# EAGLE design EVB2_MC33812_Rev 2.2 (EAGLE 4.15)
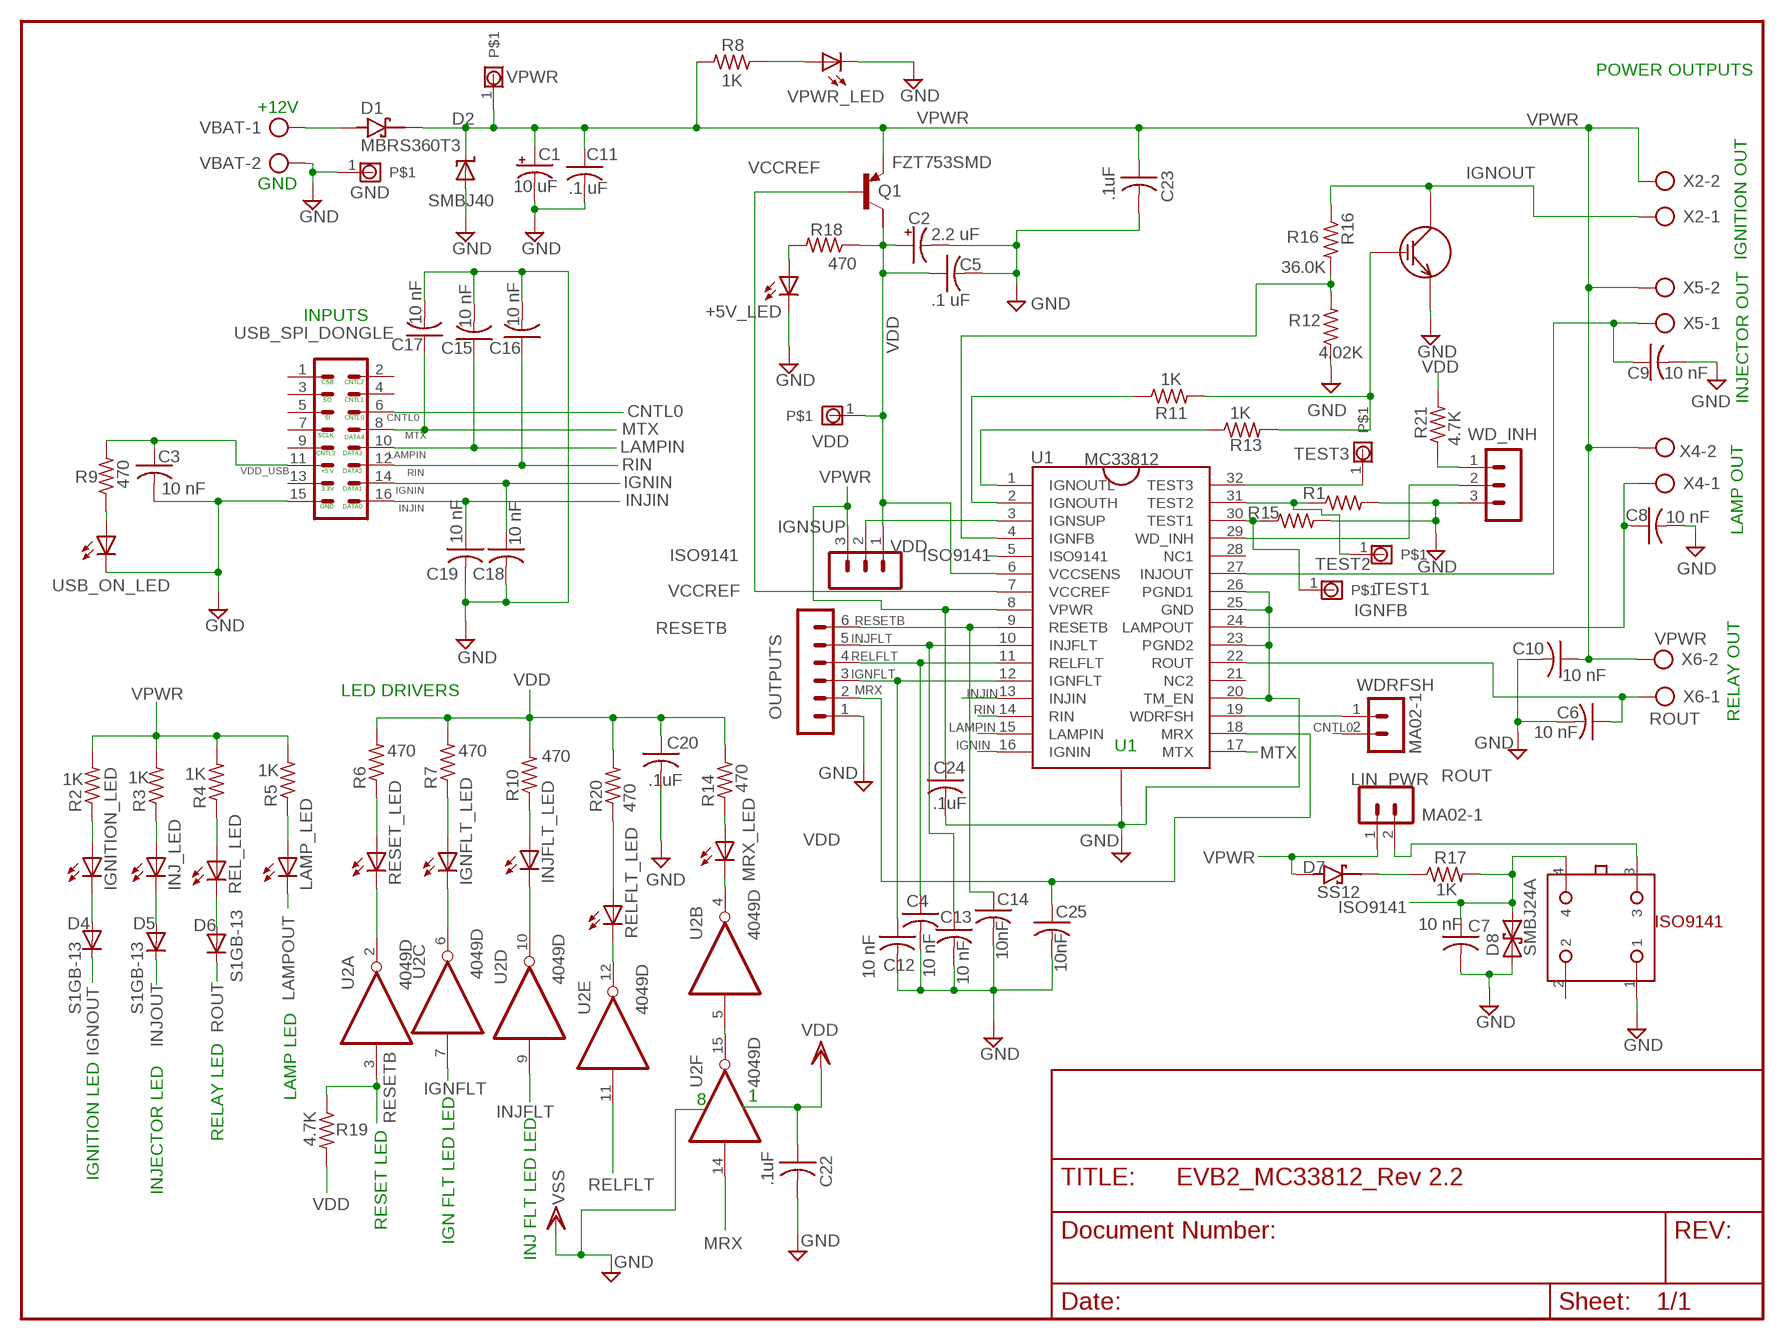
[diagram p0: schematic, sheet 1]

## Parts
+5V_LED  LEDCHIPLED_0805  [CHIPLED_0805]
C1  10 uF  CPOL-USE  [PANASONIC_E]
C2  2.2 uF  CPOL-USC  [PANASONIC_C]
C3  10 nF  C-USC0805  [C0805]
C4  10 nF  C-USC0805  [C0805]
C5  .1 uF  C-USC0805  [C0805]
C6  10 nF  C-USC0805  [C0805]
C7  10 nF  C-USC0805  [C0805]
C8  10 nF  C-USC0805  [C0805]
C9  10 nF  C-USC0805  [C0805]
C10  10 nF  C-USC0805  [C0805]
C11  .1 uF  C-USC0805  [C0805]
C12  10 nF  C-USC0805  [C0805]
C13  10 nF  C-USC0805  [C0805]
C14  10nF  C-USC0805  [C0805]
C15  10 nF  C-USC0805  [C0805]
C16  10 nF  C-USC0805  [C0805]
C17  10 nF  C-USC0805  [C0805]
C18  10 nF  C-USC0805  [C0805]
C19  10 nF  C-USC0805  [C0805]
C20  .1uF  C-USC0805  [C0805]
C22  .1uF  C-USC0805  [C0805]
C23  .1uF  C-USC0805  [C0805]
C24  .1uF  C-USC0805  [C0805]
C25  10nF  C-USC0805  [C0805]
D1  MBRS360T3  [SMC]
D2  SMBJ40  [DO214AA]
D4  S1GB-13  [DO214AA]
D5  S1GB-13  [DO214AA]
D6  S1GB-13  [DO214AA]
D7  SS12  [DO214AC]
D8  SMBJ24A  [DO214AA]
IGNFLT_LED  LEDCHIPLED_0805  [CHIPLED_0805]
IGNITION_LED  LEDCHIPLED_0805  [CHIPLED_0805]
IGNSUP  MA03-1  [MA03-1]
INJ_LED  LEDCHIPLED_0805  [CHIPLED_0805]
INJFLT_LED  LEDCHIPLED_0805  [CHIPLED_0805]
ISO9141  44068ANGLE  [5566-4A]
LAMP_LED  LEDCHIPLED_0805  [CHIPLED_0805]
LIN_PWR  MA02-1  [MA02-1]
MRX_LED  LEDCHIPLED_0805  [CHIPLED_0805]
OUTPUTS  MA06-1  [MA06-1]
Q1  FZT753SMD  [SOT223]
Q3  IRGS14C40L  [T0263N]
R1  R-US_R0805  [R0805]
R2  1K  R-US_M0805  [M0805]
R3  1K  R-US_M0805  [M0805]
R4  1K  R-US_M0805  [M0805]
R5  1K  R-US_M0805  [M0805]
R6  470  R-US_M0805  [M0805]
R7  470  R-US_M0805  [M0805]
R8  1K  R-US_M0805  [M0805]
R9  470  R-US_M0805  [M0805]
R10  470  R-US_M0805  [M0805]
R11  1K  R-US_M0805  [M0805]
R12  4.02K  R-US_R1206  [R1206]
R13  1K  R-US_M0805  [M0805]
R14  470  R-US_M0805  [M0805]
R15  R-US_R0805  [R0805]
R16  36.0K  R-US_R2512  [R2512]
R17  1K  R-US_M0805  [M0805]
R18  470  R-US_M0805  [M0805]
R19  4.7K  R-US_M0805  [M0805]
R20  470  R-US_M0805  [M0805]
R21  4.7K  R-US_M0805  [M0805]
REL_LED  LEDCHIPLED_0805  [CHIPLED_0805]
RELFLT_LED  LEDCHIPLED_0805  [CHIPLED_0805]
RESET_LED  LEDCHIPLED_0805  [CHIPLED_0805]
TEST1  MA01-1  [MA01-1]
TEST2  MA01-1  [MA01-1]
TEST3  MA01-1  [MA01-1]
U1  MC33812A  [32SOICEP_FINAL]
U2  4049D  [SO16]
U$2  MA01-1  [MA01-1]
USB_ON_LED  LEDCHIPLED_0805  [CHIPLED_0805]
USB_SPI_DONGLE  MA08-2  [MA08-2]
VBAT  AK500/2  [AK500/2]
VDD  MA01-1  [MA01-1]
VPWR  MA01-1  [MA01-1]
VPWR_LED  LEDCHIPLED_0805  [CHIPLED_0805]
WD_INH  MA03-1  [MA03-1]
WDRFSH  MA02-1  [MA02-1]
X2  AK500/2  [AK500/2]
X4  AK500/2  [AK500/2]
X5  AK500/2  [AK500/2]
X6  AK500/2  [AK500/2]

## Nets
CNTL0: USB_SPI_DONGLE.6 WDRFSH.2
GND: +5V_LED.C C1.- C2.- C3.2 C4.2 C5.2 C6.2 C7.2 C8.2 C9.2 C10.2 C11.2 C12.2 C13.2 C14.2 C15.2 C16.2 C17.2 C18.2 C19.2 C20.2 C22.2 C23.2 C24.2 C25.2 D2.A D8.A ISO9141.1 OUTPUTS.1 Q3.E R1.2 R12.1 R15.2 U1.20(TM_EN) U1.23(PGND2) U1.25(GND) U1.26(PGND1) U1.P$1(PAD_GND_0) U$2.1 USB_ON_LED.C USB_SPI_DONGLE.15 VBAT.2 VPWR_LED.C WD_INH.3 ; supply symbol labelled VSS
IGNFB: R12.2 R16.2 U1.4(IGNFB)
IGNFLT: C12.1 OUTPUTS.3 U1.12(IGNFLT) U2.7(C:I)
IGNFLT_LED_A: IGNFLT_LED.A R7.1
IGNFLT_LED_C: IGNFLT_LED.C U2.6(C:O)
IGNIN: C18.1 U1.16(IGNIN) USB_SPI_DONGLE.14
IGNOUT: D4.C Q3.C R16.1 X2.1
IGNOUTH: R11.1 U1.2(IGNOUTH)
IGNOUTL: R13.1 U1.1(IGNOUTL)
IGNSUP: IGNSUP.2 U1.3(IGNSUP)
INJFLT: C13.1 OUTPUTS.5 U1.10(INJFLT) U2.9(D:I)
INJFLT_LED_A: INJFLT_LED.A R10.1
INJFLT_LED_C: INJFLT_LED.C U2.10(D:O)
INJIN: C19.1 U1.13(INJIN) USB_SPI_DONGLE.16
INJOUT: C9.1 D5.C U1.27(INJOUT) X5.1
ISO9141: C7.1 D8.C ISO9141.4 R17.2 U1.5(ISO9141)
LAMP_LED_A: LAMP_LED.A R5.1
LAMPIN: C15.1 U1.15(LAMPIN) USB_SPI_DONGLE.10
LAMPOUT: C8.1 LAMP_LED.C U1.24(LAMPOUT) X4.1
MRX: C25.1 OUTPUTS.2 U1.18(MRX) U2.14(F:I)
MRX_LED_A: MRX_LED.A R14.1
MRX_LED_C: MRX_LED.C U2.4(B:O)
MTX: C17.1 U1.17(MTX) USB_SPI_DONGLE.8
N$1: +5V_LED.A R18.2
N$2: R21.1 WD_INH.1
N$4: U2.5(B:I) U2.15(F:O)
N$7: IGNITION_LED.A R2.1
N$8: INJ_LED.A R3.1
N$9: R4.1 REL_LED.A
N$12: D4.A IGNITION_LED.C
N$13: D5.A INJ_LED.C
N$14: D6.A REL_LED.C
N$18: R8.1 VPWR_LED.A
N$21: ISO9141.3 LIN_PWR.2
N$23: D7.C R17.1
N$33: Q3.G R11.2 R13.2
N$43: R9.1 USB_ON_LED.A
RELFLT: C4.1 OUTPUTS.4 U1.11(RELFLT) U2.11(E:I)
RELFLT_LED_A: R20.1 RELFLT_LED.A
RELFLT_LED_C: RELFLT_LED.C U2.12(E:O)
RESET_LED_A: R6.1 RESET_LED.A
RESET_LED_C: RESET_LED.C U2.2(A:O)
RESETB: C14.1 OUTPUTS.6 R19.1 U1.9(RESETB) U2.3(A:I)
RIN: C16.1 U1.14(RIN) USB_SPI_DONGLE.12
ROUT: C6.1 D6.C U1.22(ROUT) X6.1
TEST1: R15.1 TEST2.1 U1.30(TEST1)
TEST2: R1.1 TEST1.1 U1.31(TEST2)
TEST3: TEST3.1 U1.32(TEST3)
VBAT: D1.A VBAT.1
VCCREF: Q1.1(B) U1.7(VCCREF)
VDD: C2.+ C5.1 C20.1 C22.1 IGNSUP.1 Q1.2(C) R6.2 R7.2 R10.2 R14.2 R18.1 R19.2 R20.2 R21.2 U1.6(VCCSENS) VDD.1
VDD_USB: C3.1 R9.2 USB_SPI_DONGLE.11
VPWR: C1.+ C10.1 C11.1 C23.1 C24.1 D1.C D2.C D7.A IGNSUP.3 LIN_PWR.1 Q1.3(E) R2.2 R3.2 R4.2 R5.2 R8.2 U1.8(VPWR) VPWR.1 X2.2 X4.2 X5.2 X6.2
WD_INH: U1.29(WD_INH) WD_INH.2
WDRFSH: U1.19(WDRFSH) WDRFSH.1
Unconnected: ISO9141.2 Q1.4(C/) U1.21(NC2) U1.28(NC1) USB_SPI_DONGLE.1 USB_SPI_DONGLE.2 USB_SPI_DONGLE.3 USB_SPI_DONGLE.4 USB_SPI_DONGLE.5 USB_SPI_DONGLE.7 USB_SPI_DONGLE.9 USB_SPI_DONGLE.13

## Notes on the sheet
- POWER OUTPUTS
- +12V
- IGNITION OUT
- GND
- R16
- INPUTS
- CSB | CNTL2
- SO | CNTL1
- INJECTOR OUT
- SI | CNTL0
- SCLK
- DATA4
- CNTL3 | DATA3
- +5 V | DATA2
- 3.3V | DATA1
- GND | DATA0
- LAMP OUT
- LED DRIVERS
- RELAY OUT
- U1
- LAMP LED | 1
- 8
- RELAY LED
- IGNITION LED
- INJECTOR LED
- RESET LED
- IGN FLT LED LED
- INJ FLT LED LED

## Power pins joined to a net without a drawn wire
GND: U2.8(P:VSS)
VDD: U2.1(P:VDD)

## Library data of the parts
+5V_LED IGNFLT_LED IGNITION_LED INJ_LED INJFLT_LED LAMP_LED MRX_LED REL_LED RELFLT_LED RESET_LED USB_ON_LED VPWR_LED = led:LED: LED OSRAM: - CHIPLED LG R971, LG N971, LY N971, LG Q971, LY Q971, LO R971, LY R971 LH N974, LH R974 LS Q976, LO Q976, LY Q976 LO Q996 - Hyper CHIPLED LW Q18S LB Q993, LB Q99A, LB R99A - SideLED LS A670, LO A670, LY A670, LG A670, LP A670 LB A673, LV A673, LT A673, LW A673 LH A674 LY A675 LS A676, LA A676, LO A676, LY A676, LW A676 LS A679, LY A679, LG A679 - Hyper Micro SIDELED® LS Y876, LA Y876, LO Y876, LY Y876 LT Y87S - SmartLED LW L88C, LW L88S LB L89C, LB L89S, LG L890 LS L89K, LO L89K, LY L89K LS L896, LA L896, LO L896, LY L896 - TOPLED LS T670, LO T670, LY T670, LG T670, LP T670 LSG T670, LSP T670, LSY T670, LOP T670, LYG T670 LG T671, LOG T671, LSG T671 LB T673, LV T673, LT T673, LW T673 LH T674 LS T676, LA T676, LO T676, LY T676, LB T676, LH T676, LSB T676, LW T676 LB T67C, LV T67C, LT T67C, LS T67K, LO T67K, LY T67K, LW E67C LS E67B, LA E67B, LO E67B, LY E67B, LB E67C, LV E67C, LT E67C LW T67C LS T679, LY T679, LG T679 LS T770, LO T770, LY T770, LG T770, LP T770 LB T773, LV T773, LT T773, LW T773 LH T774 LS E675, LA E675, LY E675, LS T675 LS T776, LA T776, LO T776, LY T776, LB T776 LHGB T686 LT T68C, LB T68C - Hyper Mini TOPLED® LB M676 - Mini TOPLED Santana® LG M470 LS M47K, LO M47K, LY M47K Source: http://www.osram.convergy.de/
C1 C2 = rcl:CPOL-US: POLARIZED CAPACITOR, American symbol
C3-C20 C22-C25 = rcl:C-US: CAPACITOR, American symbol
D1 = diode:MBRS360T3
D2 = diode:SMBJ40
D4-D6 = diode:S1GB-13
D7 = diode:SS12
D8 = diode:SMBJ24A
IGNSUP WD_INH = con-lstb:MA03-1: PIN HEADER
ISO9141 = con-molex:44068ANGLE
LIN_PWR WDRFSH = con-lstb:MA02-1
OUTPUTS = con-lstb:MA06-1: PIN HEADER
Q1 = transistor-pnp:FZT753SMD: PNP Transistor
Q3 = APD:IRGS14C40L
R1-R21 = rcl:R-US_: RESISTOR, American symbol
TEST1-TEST3 U$2 VDD VPWR = con-lstb:MA01-1
U1 = SeaBreeze_EVB:MC33812A
U2 = 40xx:4049: Hex inverting BUFFER
USB_SPI_DONGLE = con-lstb:MA08-2: PIN HEADER
VBAT X2 X4-X6 = con-ptr500:AK500/2: CONNECTOR

## Board
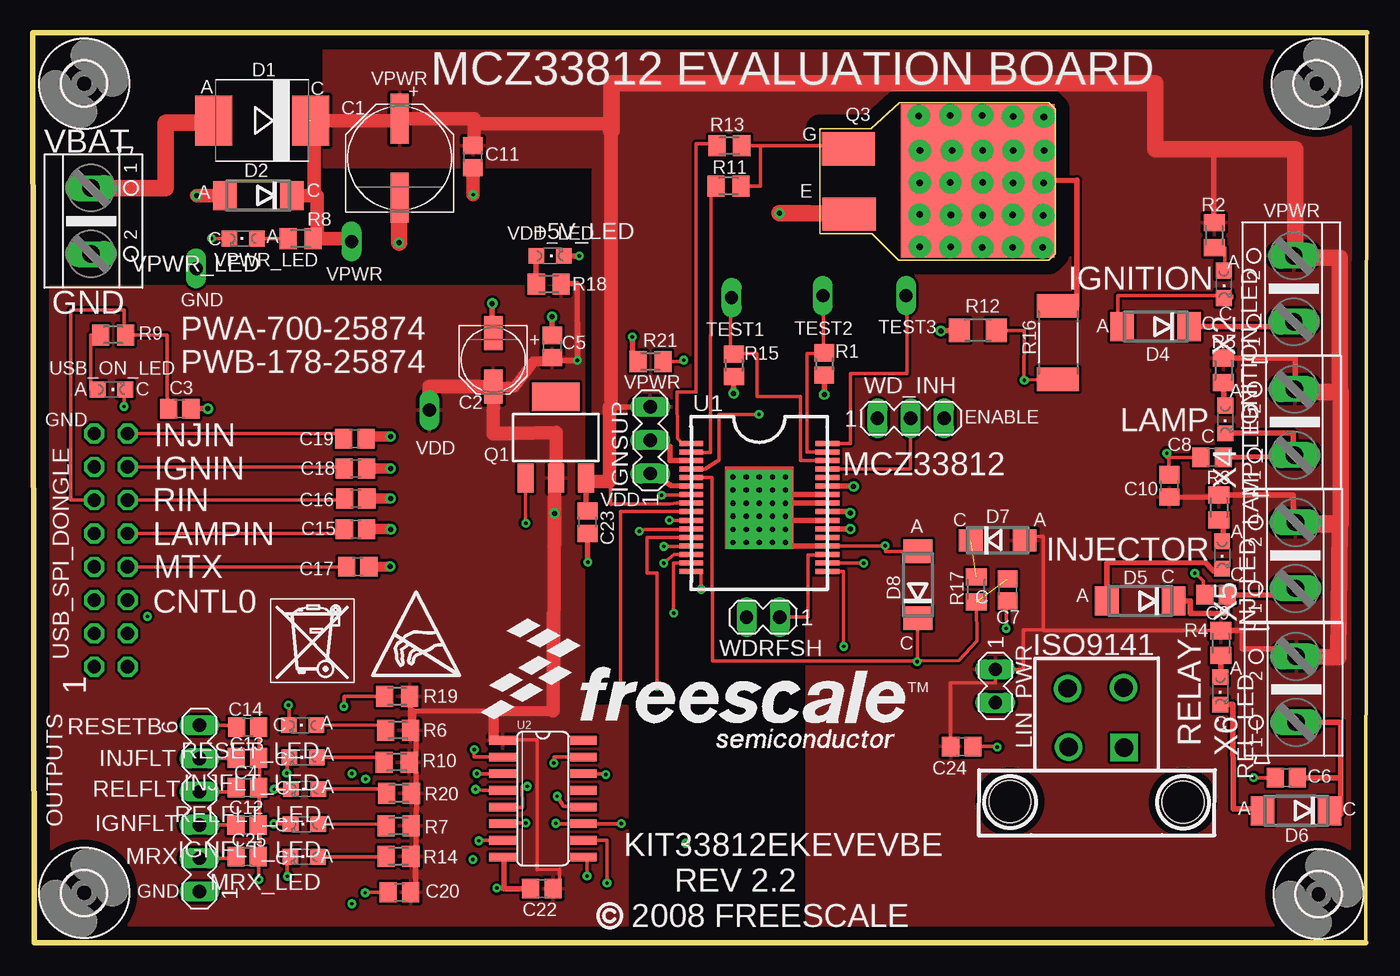
[diagram p1: board, top side]
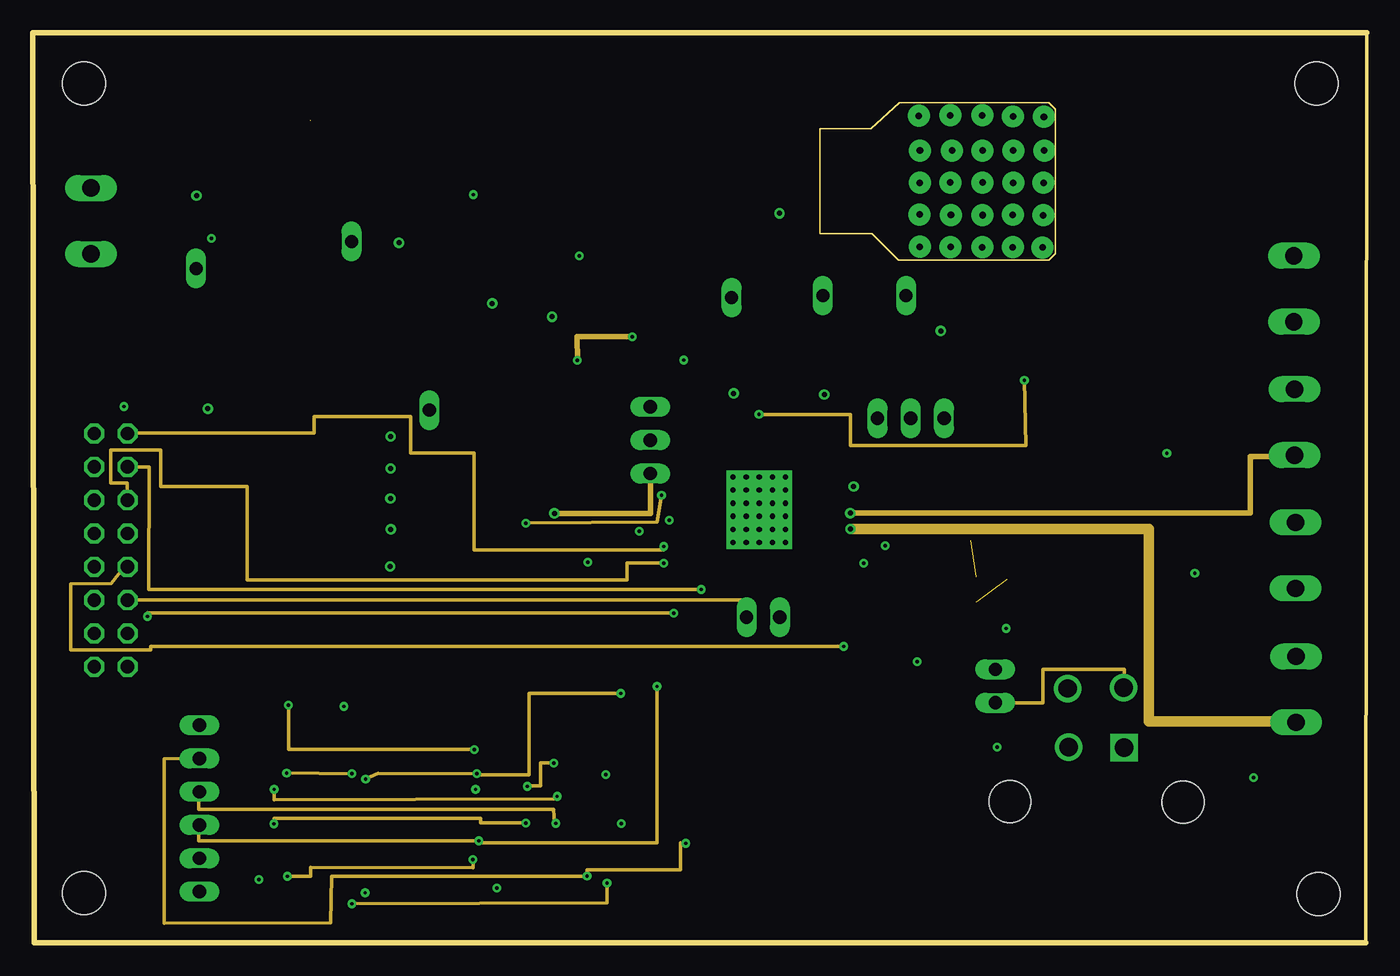
[diagram p2: board, inner layer Route2]
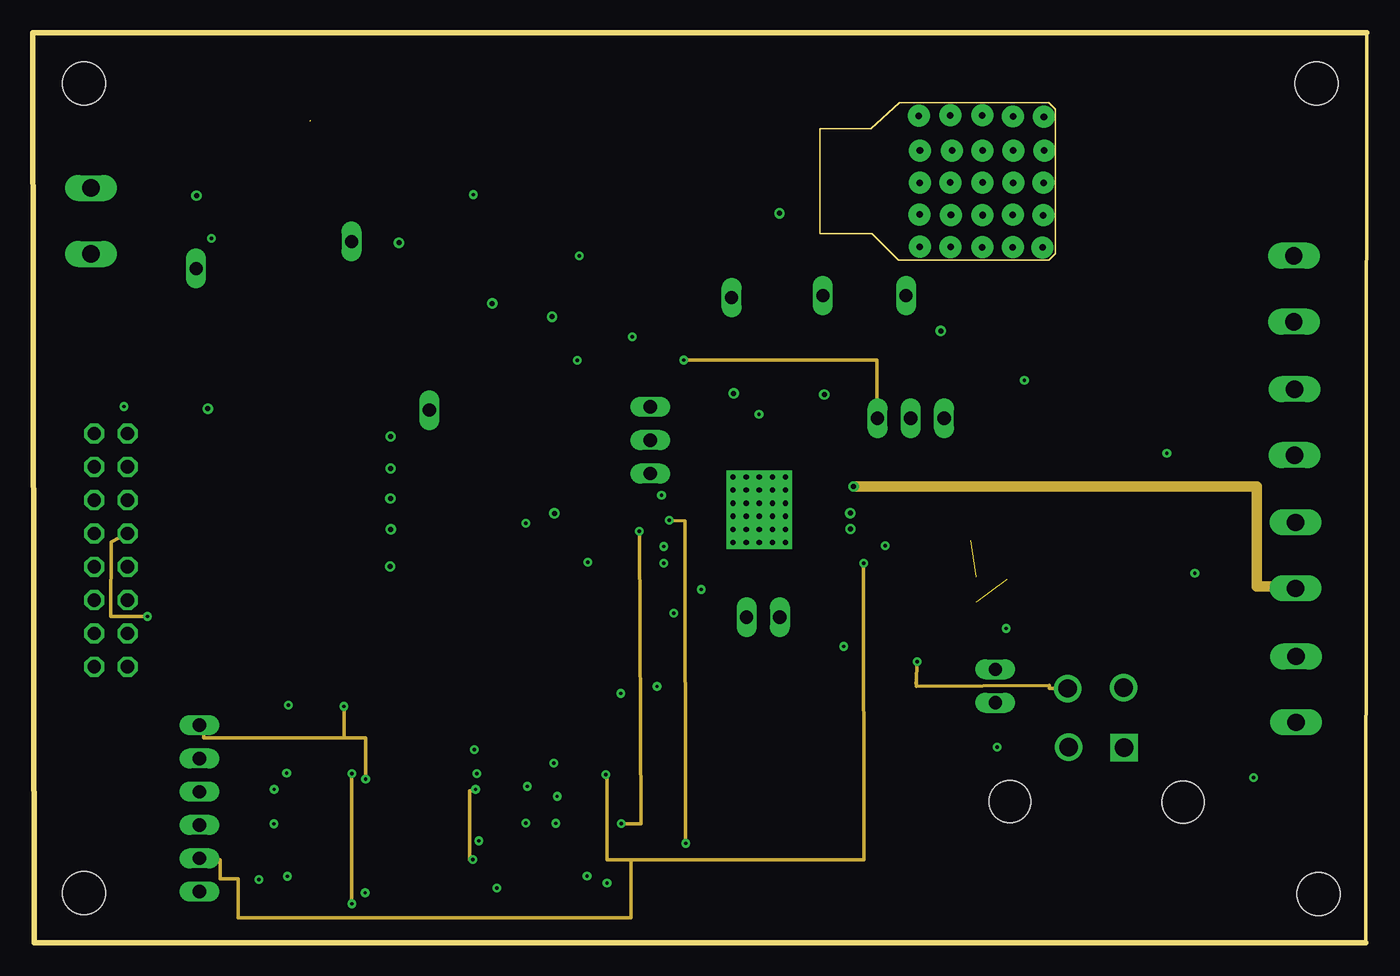
[diagram p3: board, inner layer Route15]
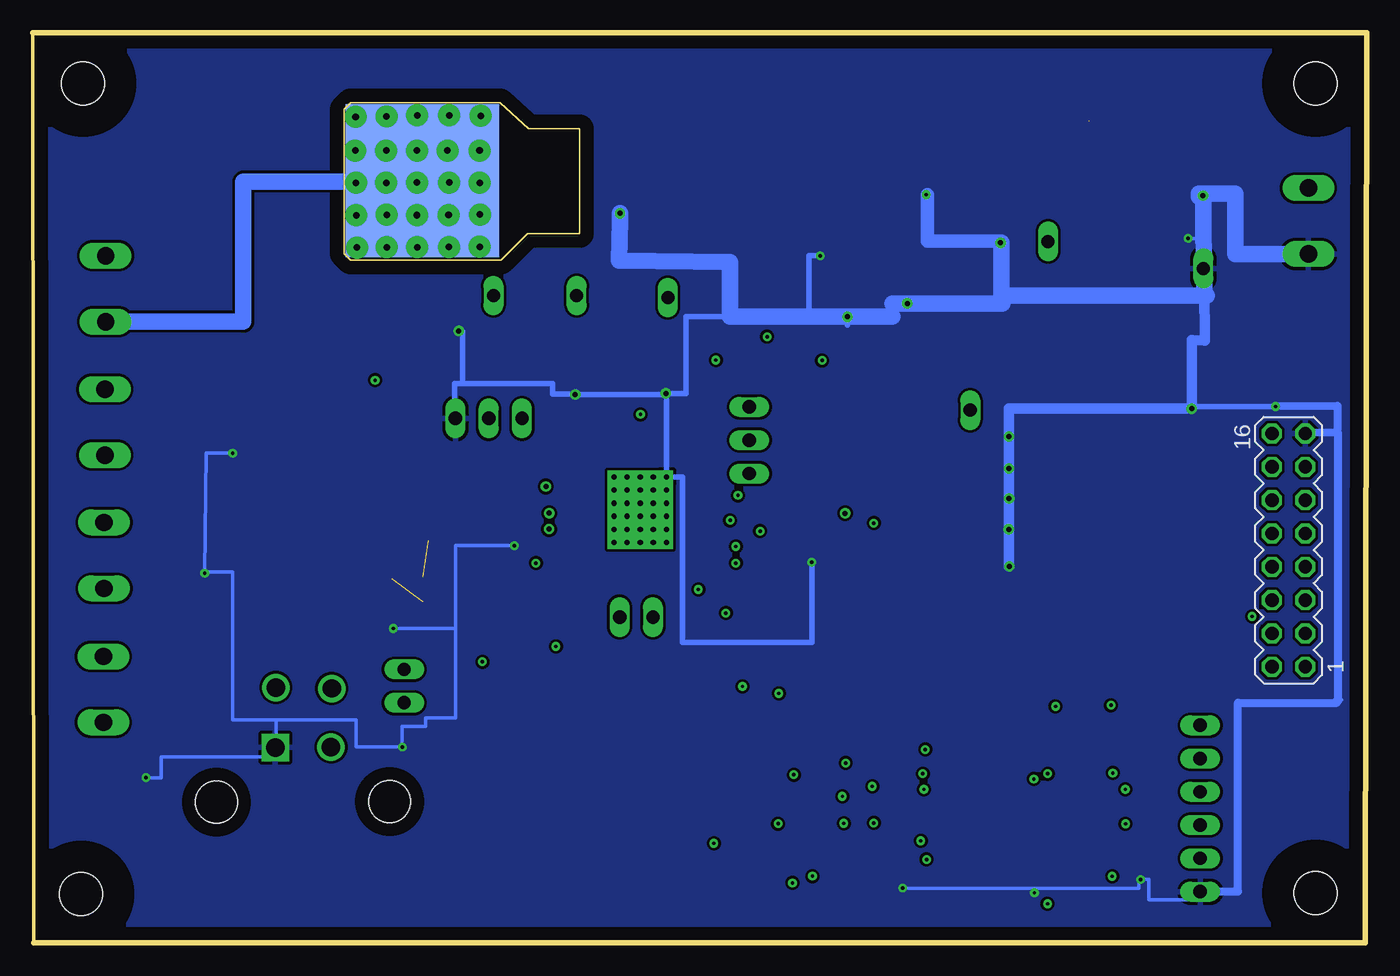
[diagram p4: board, bottom side, seen from below]

Size 101.7 x 69.4 mm. Coordinates in mm from the lower left corner, seen from the top.
Outline: 0.1,0 0,69.4 101.7,69.4 101.62,0 0.1,0
Copper layers (1*2*15*16): Top 0.035mm / dielectric 1.5mm / Route2 0.035mm / dielectric 0.15mm / Route15 0.035mm / dielectric 0.2mm / Bottom 0.035mm
Design rules "default": minimum track width 5mil, minimum drill 10mil, track to track 8mil, track to pad 8mil, pad to pad 8mil, via to via 8mil, smd to smd 8mil, copper to edge 40mil, drill to drill 8mil, minimum pad ring 10mil, minimum via ring 8mil, stop-mask expansion 4mil, vias tented up to drill 0mil, thermal gap 10mil

### Footprints (pad centres in the part's own frame; a part is rotated, then mirrored left to right if it is on the bottom)
CHIPLED_0805 = smd 1.2 x 1.2: A 0,-1.05; C 0,1.05
PANASONIC_E = smd 3.8 x 1.4: + 3,0; - -3,0
PANASONIC_C = smd 2.6 x 1.4: + 2.05,0; - -2.05,0
C0805 = smd 1.3 x 1.5: 1 -0.85,0; 2 0.85,0
SMC = smd 2.8 x 3.8: A 3.7,0; C -3.7,0
DO214AA = smd 1.8 x 2.2: A 2.55,0; C -2.55,0
DO214AC = smd 1.8 x 1.7: A 2.05,0; C -2.05,0
MA03-1 = drill 1.016 long: 1 -2.54,0; 2 0,0; 3 2.54,0
5566-4A = drill 1.4 square: 1 2.109,-2.312 | drill 1.4 round: 2 -2.131,-2.281; 3 2.063,2.261; 4 -2.194,2.193 | hole 3.2: -6.604,-6.446; 6.606,-6.464
MA02-1 = drill 1.016 long: 1 -1.27,0; 2 1.27,0
MA06-1 = drill 1.016 long: 1 -6.35,0; 2 -3.81,0; 3 -1.27,0; 4 1.27,0; 5 3.81,0; 6 6.35,0
SOT223 = smd 1.219 x 2.235: 1 -2.311,-3.099; 2 0,-3.099; 3 2.311,-3.099 | smd 3.6 x 2.2: 4 0,3.099
T0263N = smd 11.684 x 11.684 bottom: C -0.146,-0.41 | smd 2.54 x 4.064: E 2.415,-10.163; G -2.563,-10.225 | drill 0.5 pad 1.676 round: P$1 -5.007,4.675; P$2 4.912,-2.438; P$3 -2.435,4.698; P$4 0.014,4.653; P$5 2.44,-4.807; P$6 2.496,4.631; P$7 4.901,-4.784; P$8 -2.445,-4.776; P$9 -5.04,2.316; P$10 -2.435,2.338; P$11 0.014,2.338; P$12 2.463,2.293; P$13 4.934,2.293; P$14 4.945,4.575; P$15 0.025,-4.785; P$16 -5.13,-0.021; P$17 -2.435,0.001; P$18 -0.009,0.001; P$19 2.485,0.001; P$20 4.934,-0.021; P$22 -5.132,-2.461; P$23 -5.085,-4.863; P$24 0.003,-2.461; P$25 2.469,-2.416; P$26 -2.435,-2.336 | smd 11.684 x 11.684: P$28 -0.12,-0.385
R0805 = smd 1.3 x 1.5: 1 -0.85,0; 2 0.85,0
M0805 = smd 1.3 x 1.6: 1 -0.95,0; 2 0.95,0
R1206 = smd 1.6 x 1.803: 1 -1.422,0; 2 1.422,0
R2512 = smd 1.8 x 3.2: 1 -2.8,0; 2 2.8,0
MA01-1 = drill 1 long: 1 0,0
32SOICEP_FINAL = smd 1.8 x 0.38: 1 -5.2,4.55; 2 -5.2,3.9; 3 -5.2,3.25; 4 -5.2,2.6; 5 -5.2,1.95; 6 -5.2,1.3; 7 -5.2,0.65; 8 -5.2,0; 9 -5.2,-0.65; 10 -5.2,-1.3; 11 -5.2,-1.95; 12 -5.2,-2.6; 13 -5.2,-3.25; 14 -5.2,-3.9; 15 -5.2,-4.55; 16 -5.2,-5.2; 17 5.2,-5.2; 18 5.2,-4.55; 19 5.2,-3.9; 20 5.2,-3.25; 21 5.2,-2.6; 22 5.2,-1.95; 23 5.2,-1.3; 24 5.2,-0.65; 25 5.2,0; 26 5.2,0.65; 27 5.2,1.3; 28 5.2,1.95; 29 5.2,2.6; 30 5.2,3.25; 31 5.2,3.9; 32 5.2,4.55 | drill 0.4 pad 1.016 square: P$1 -2,2; P$2 -1,2; P$3 0,2; P$4 1,2; P$5 2,2; P$6 -2,1; P$7 -1,1; P$8 0,1; P$9 1,1; P$10 2,1; P$11 -2,0; P$12 -1,0; P$13 0,0; P$14 1,0; P$15 2,0; P$16 -2,-1; P$17 -1,-1; P$18 0,-1; P$19 1,-1; P$20 2,-1; P$21 -2,-2; P$22 -1,-2; P$23 0,-2; P$24 1,-2; P$25 2,-2; P$26 -2,-3; P$27 -1,-3; P$28 0,-3; P$29 1,-3; P$30 2,-3
SO16 = smd 0.66 x 2.032: 1 -4.445,-3.073; 2 -3.175,-3.073; 3 -1.905,-3.073; 4 -0.635,-3.073; 5 0.635,-3.073; 6 1.905,-3.073; 7 3.175,-3.073; 8 4.445,-3.073; 9 4.445,3.073; 10 3.175,3.073; 11 1.905,3.073; 12 0.635,3.073; 13 -0.635,3.073; 14 -1.905,3.073; 15 -3.175,3.073; 16 -4.445,3.073
3,3 = hole 3.3: 0,0
MA08-2 = drill 1.016 octagon: 1 -8.89,-1.27; 2 -8.89,1.27; 3 -6.35,-1.27; 4 -6.35,1.27; 5 -3.81,-1.27; 6 -3.81,1.27; 7 -1.27,-1.27; 8 -1.27,1.27; 9 1.27,-1.27; 10 1.27,1.27; 11 3.81,-1.27; 12 3.81,1.27; 13 6.35,-1.27; 14 6.35,1.27; 15 8.89,-1.27; 16 8.89,1.27
AK500/2 = drill 1.321 long: 1 -2.515,0; 2 2.515,0

### Placement (x,y rotation side)
+5V_LED  39.44,52.39 270 top
C1  27.97,59.84 90 top
C2  35.1,44.46 270 top
C3  11.21,40.73 0 top
C4  16.37,11.83 0 top
C5  39.6,45.48 90 top
C6  95.57,12.59 180 top
C7  74.32,26.91 270 top
C8  89.92,37.03 180 top
C9  90.22,26.54 180 top
C10  86.65,34.85 90 top
C11  33.56,59.95 270 top
C12  16.34,8.99 0 top
C13  16.36,14.11 0 top
C14  16.38,16.45 0 top
C15  24.61,31.56 0 top
C16  24.62,33.88 0 top
C17  24.77,28.68 0 top
C18  24.6,36.17 0 top
C19  24.55,38.44 0 top
C20  27.96,3.86 180 top
C22  38.81,4.14 180 top
C23  42.3,32.08 270 top
C24  70.83,14.98 0 top
C25  16.34,6.57 0 top
D1  17.49,62.71 180 top
D2  17.2,56.99 180 top
D4  85.61,47 180 top
D5  84.44,26.07 180 top
D6  96.33,10.08 180 top
D7  73.57,30.69 0 top
D8  67.48,27.31 90 top
E$1  [2007COPYRIGHTFREESCALE]  43.1,1.44 0 top
E$2  [HANDSYMBOL]  25.93,20.4 0 top
E$3  [TRASHCANSYMBOL]  18.13,19.88 0 top
E$4  [FREESCALESEMIW/LOGO]  34.09,17.57 0 top
IGNFLT_LED  20.71,9.06 90 top
IGNITION_LED  90.82,50.22 180 top
IGNSUP  47.07,38.33 90 top
INJ_LED  90.68,29.58 180 top
INJFLT_LED  20.61,14.15 90 top
ISO9141  81.1,17.21 0 top
LAMP_LED  90.92,39.92 180 top
LIN_PWR  73.39,19.59 270 top
MRX_LED  20.68,6.57 90 top
OUTPUTS  12.7,10.25 90 top
Q1  39.88,38.54 0 top
Q3  72.42,57.98 270 top
R1  60.34,44.15 270 top
R2  90.07,53.98 90 top
R3  90.43,33.21 90 top
R4  90.58,22.86 90 top
R5  90.78,43.66 90 top
R6  27.85,16.21 0 top
R7  27.89,8.91 0 top
R8  20.44,53.71 0 top
R9  6.14,46.36 0 top
R10  27.75,13.78 0 top
R11  53.03,57.71 0 top
R12  72.06,46.71 0 top
R13  53.1,60.78 0 top
R14  27.88,6.6 0 top
R15  53.46,44.04 270 top
R16  78.17,45.78 270 top
R17  71.93,26.97 270 top
R18  39.34,50.25 180 top
R19  27.79,18.8 0 top
R20  27.91,11.4 0 top
R21  47.09,44.34 180 top
REL_LED  90.53,19.22 180 top
RELFLT_LED  20.73,11.73 90 top
RESET_LED  20.58,16.6 90 top
TEST1  60.24,49.36 0 top
TEST2  53.28,49.21 0 top
TEST3  66.58,49.36 180 top
U1  55.39,33.53 0 top
U2  38.89,11 270 top
U$1  [3,3]  3.91,65.53 0 top
U$2  12.45,51.43 0 top
U$3  [3,3]  3.91,3.81 0 top
U$4  [3,3]  98.03,3.73 0 top
U$5  [3,3]  97.89,65.53 0 top
USB_ON_LED  6,42.2 270 top
USB_SPI_DONGLE  5.95,29.95 90 bottom
VBAT  4.44,55.05 270 top
VDD  30.23,40.62 180 top
VPWR  24.3,53.49 180 top
VPWR_LED  16.04,53.71 90 top
WD_INH  66.94,40 0 top
WDRFSH  55.69,24.84 180 top
X2  96.15,49.88 90 top
X4  96.2,39.71 90 top
X5  96.27,29.55 90 top
X6  96.32,19.33 90 top

### Tracks (layer width: path | path; a pad name or v marks a point on that pad's centre or on a via)
CNTL0
  Route2 0.254: WDRFSH.2 54.46,24.84 54.46,26.14 USB_SPI_DONGLE.6
GND  (via drill 0.25, 0.25 pad 0.25, 0.38)
  Top 0.254: 25.45,3.81 v25.34,3.82 v25.35,3.82 | USB_ON_LED.C 6.96,42.2 v6.96,40.89 | VPWR_LED.C 13.8,53.71 v13.63,53.71 | 17.63,8.98 C12.2 17.26,8.98 | C25.2 17.37,6.62 17.63,6.62 17.63,6.6 | 17.26,14.11 17.26,13.96 | 17.26,14.11 C13.2 17.28,14.11 17.28,11.83 | C14.2 17.26,16.45 17.26,14.11 | 17.28,11.83 17.28,11.72 | 17.28,11.83 C4.2 17.63,11.8 17.26,11.8 17.26,8.98 | 17.26,8.98 17.26,8.8 17.33,8.8 17.33,6.57 | 17.33,6.57 | C25.2 17.33,6.57 | C25.2 17.23,6.57 v17.23,4.83 | 35.92,4.14 35.38,4.14 v35.38,4.18 | v25.35,3.82 25.35,3.8 | C20.2 25.35,3.87 v25.35,3.82 | 67.41,30.28 67.41,29.86 D8.A 64.99,29.86 v64.99,30.29 v64.99,30.28 U1.20 | C24.2 73.54,14.98 v73.54,14.94 | 86.46,37.03 C8.2 | v86.46,37.34 86.46,37.03 | 89.25,26.54 89.25,26.42 | 89.25,26.54 C9.2 | v88.6,28.2 89.25,27.59 89.25,26.54 | C10.2 86.62,35.7 86.62,37.03 86.46,37.03 | C6.2 v93.08,12.59 v93.08,12.6 | C7.2 74.22,26.06 v74.22,23.98
  Top 0.406: C23.2 v42.31,29.03 | 60.19,30.28 60.19,30.29 | 60.19,30.28 U1.20 56.23,30.28 56.23,32.51 | 60.19,30.28 60.22,30.27 | 53.36,35.53 53.36,35.65 | U1.P$1 53.36,35.53 | 56.23,34.18 53.36,34.18 53.36,35.53 | 56.23,34.18 U1.26 | 56.23,33.53 56.23,32.51 | 56.23,34.18 56.23,33.53 | U1.23 56.23,32.23 56.23,32.51 | U1.25 56.23,33.53 | C3.2 | v13.35,40.73 C3.2 | C3.2 12.07,40.78 | 27.92,56.84 C1.- | C2.- 35.03,46.51 v35.03,48.76 | +5V_LED.C v41.68,52.39 v41.68,52.4 | C5.2 v39.6,47.75 | R15.2 53.44,43.19 v53.44,41.91 | R1.2 60.37,43.3 v60.35,41.81 | R12.1 69.23,46.71 v69.23,46.66 | U2.8 35.92,6.56 35.92,4.14 C22.2 | 33.59,59.1 C11.2
  Top 0.813: 25.5,38.44 25.5,38.35 | 25.5,38.44 C19.2 | v27.28,38.61 25.5,38.61 25.5,38.44 | C17.2 27.22,28.7 v27.24,28.7 | C15.2 27.3,31.55 v27.3,31.53 | C16.2 v27.27,33.88 v27.27,33.89 | C18.2 v27.29,36.17
  Top 1.016: D2.A v12.48,56.99 v12.48,56.98 | v33.59,57.05 33.59,59.1
  Top 1.27: v27.92,53.39 27.92,56.84 | Q3.E 59.21,55.64 v56.94,55.64
  Bottom 0.254: 4.16,38.61 4.16,38.84 4.16,38.86 | 12.47,53.74 12.47,53.71 v13.63,53.71 | 2.17,18.53 1.91,18.53 2.01,18.53 | 25.25,3.82 25.25,3.81 | 25.25,3.82 v25.34,3.82 | 25.25,4.18 v35.38,4.18 | 25.25,4.18 25.25,3.82 | OUTPUTS.1 12.55,3.9 12.55,3.3 16.61,3.3 16.61,4.83 v17.23,4.83 17.37,4.83 17.37,4.18 25.25,4.18 | 83.16,14.9 83.16,14.73 | 83.16,14.9 ISO9141.1 83,14.9 83,14.17 91.93,14.17 91.93,12.6 v93.08,12.6 | 83.16,17.02 77.06,17.02 77.06,14.94 v73.54,14.94 73.56,14.94 | 83.16,17.02 83.16,14.9 | v86.46,37.34 88.49,37.34 v88.6,28.2 88.63,28.2 | 83.16,17.02 86.45,17.02 86.45,28.28 88.63,28.28 88.63,28.2 | 88.63,28.2 88.63,28.1 | v64.99,30.29 69.46,30.29 69.46,24.02 | 69.46,24.02 69.46,17.17 71.74,17.17 71.74,16.5 73.56,16.5 73.56,14.94 | 73.56,14.94 73.56,14.91 | 69.46,24.02 69.55,24.02 69.55,23.98 v74.22,23.98
  Bottom 0.406: v42.31,29.03 42.29,29.03 42.29,22.93 52.18,22.93 52.18,35.53 | 52.18,35.53 52.18,35.55 | 52.18,35.53 U1.P$1 53.38,41.91 v53.44,41.91 | 27.85,53.39 v27.92,53.39 27.85,53.39 27.85,53.52 | 12.38,49.96 12.21,48.9 12.21,49.38 | 27.85,49.38 27.78,49.38 27.78,48.76 | v41.68,52.4 42.52,52.4 42.52,47.75 | 36.17,48.77 36.17,48.76 36.17,47.75 | 39.58,47.76 39.58,47.75 39.58,47.12 v39.6,47.75 | 48.56,47.75 51.92,47.75 51.92,41.91 v53.44,41.91 | 53.47,41.91 53.47,41.85 | v53.44,41.91 53.47,41.91 | 53.47,41.91 53.45,41.81 v60.35,41.81 60.31,42.02 60.31,41.85 62.08,41.85 62.08,42.66 68.94,42.66 | WD_INH.3 69.53,40 69.53,42.66 68.94,42.66 | v69.23,46.66 68.94,46.66 68.94,42.66 | 13.24,40.73 13.24,40.72 | 13.24,40.73 v13.35,40.73 | v6.96,40.89 13.24,40.89 13.24,40.73 | 33.51,57.05 v33.59,57.05
  Bottom 0.61: 4.16,38.84 USB_SPI_DONGLE.15 | 2.21,38.92 4.16,38.86 | v6.96,40.89 2.21,40.96 2.21,38.92 | 2.17,18.53 2.17,18.44 | 2.17,18.53 | 2.21,38.92 2.17,38.86 2.17,18.53 | OUTPUTS.1 9.81,3.9 9.81,18.32 2.28,18.32 2.28,18.53 2.17,18.53
  Bottom 0.813: 12.38,49.96 12.36,45.93 13.35,45.97 v13.35,40.73 | v13.35,40.73 27.28,40.73 v27.28,38.61 27.28,36.07 | v27.24,28.7 27.28,28.7 27.28,31.51 | 27.28,36.07 27.28,33.87 | 27.28,33.87 27.28,31.51 | 27.28,31.51 27.3,31.51 v27.3,31.53 | 27.28,33.87 27.27,33.87 v27.27,33.89 | v27.29,36.17 27.28,36.17 27.28,36.07
  Bottom 1.016: 12.47,51.19 12.36,51.24 U$2.1 | 12.47,57.1 v12.47,56.98 v12.48,56.98 | 33.51,57.05 33.51,53.52 27.85,53.52
  Bottom 1.27: 12.47,57.1 12.47,53.74 12.36,51.24 | VBAT.2 10.01,52.53 10.01,57.15 12.8,57.15 12.8,56.98 | 12.8,56.98 12.8,56.9 | v12.48,56.98 12.8,56.98 | 12.47,51.19 12.44,51.34 12.38,49.96 | 27.85,49.38 27.85,53.39 | 12.21,49.38 27.78,49.38 | 27.78,48.76 v35.03,48.76 36.17,48.76 | 36.17,47.75 39.58,47.75 42.52,47.75 48.56,47.75 48.56,51.93 57.01,52.03 56.95,55.08 v56.94,55.64
  pour Bottom: 0.53,0.56 0.41,0.56 0.41,69.09 101.13,69.09 101.13,68.93 101.08,68.93 101.08,0.63 0.57,0.63 0.57,0.56
IGNFB  (via drill 0.25)
  Top 0.254: 73.76,46.71 73.76,46.74 | 73.76,46.71 R12.2 | 75.58,42.92 75.6,46.71 73.76,46.71 | 75.58,42.92 R16.2 | U1.4 51.24,36.13 52.33,36.83 52.31,36.83 52.31,40.27 55.36,40.27 v55.36,40.3 | v75.6,42.91 75.58,42.92
  Route2 0.254: v55.36,40.3 62.33,40.3 62.36,37.94 75.71,37.94 v75.6,42.91
IGNFLT  (via drill 0.25)
  Top 0.254: 15.85,8.98 | 15.85,8.98 C12.1 | OUTPUTS.3 15.85,8.98 | 15.85,8.98 15.85,8.89 | U2.7 34,7.83 v34,7.78 | U1.12 46.84,30.93 46.84,28.19 47.6,28.19 v47.6,19.56
  Route2 0.254: OUTPUTS.3 12.64,8.98 12.64,7.78 v34,7.78 33.88,7.78 33.88,7.62 47.6,7.62 v47.6,19.56
IGNFLT_LED_A
  Top 0.254: 26.77,8.91 26.77,8.89 | 26.77,8.91 R7.1 | IGNFLT_LED.A 26.63,9.06 26.77,8.91
IGNFLT_LED_C  (via drill 0.25)
  Top 0.254: 19.59,9.05 IGNFLT_LED.C 19.67,9.05 19.67,9.08 v18.38,9.08 | U2.6 35.91,9.1 35.91,9.14 v37.58,9.14
  Route2 0.254: v37.58,9.14 34.14,9.14 34.14,9.49 31.2,9.48 18.39,9.52 v18.38,9.08
IGNIN  (via drill 0.25)
  Top 0.254: USB_SPI_DONGLE.14 7.17,36.29 23.72,36.29 23.72,36.17 | U1.16 50.97,28.33 v50.97,26.95 | 23.72,36.17 23.72,36.07 | 23.72,36.17 C18.1
  Route2 0.254: v50.97,26.95 8.83,26.95 8.87,36.3 7.09,36.3 7.06,36.3 | 7.06,36.3 7.06,36.33 | 7.06,36.3 USB_SPI_DONGLE.14
IGNOUT  (1 unrouted)
  Top 0.406: R16.1 79.6,48.58 79.6,58.17 Q3.C 71.76,58.39 71.65,58.3 | X2.1 96.13,47.36 96.13,47 D4.C
  Bottom 0.406: 72.37,58.13 72.37,58.37 | Q3.C 72.37,58.13 | 72.37,58.13 72.37,58.05
  Bottom 1.27: X2.1 85.65,47.36 85.65,58.05 72.37,58.05
IGNOUTH
  Top 0.254: U1.2 50.39,37.43 50.39,37.41 51.66,37.41 51.69,55.44 51.72,55.41 51.72,57.7 R11.1
IGNOUTL
  Top 0.254: U1.1 49.48,38.1 49.24,38.38 49.15,38.49 49.11,42.01 50.55,42.01 50.55,60.96 52.22,60.96 52.22,60.78 R13.1
IGNSUP
  Top 0.254: IGNSUP.2 47.13,38.33
  Top 0.406: U1.3 48.59,36.78 48.59,37.84 47.04,38.35 47.13,38.33
INJFLT  (via drill 0.25)
  Top 0.254: 15.8,14.11 15.8,14.17 | 15.8,14.11 C13.1 | OUTPUTS.5 15.8,14.06 15.8,14.11 | U2.9 42.26,6.56 v42.26,5.09 | U1.10 v48.53,32.23 v48.53,32.22
  Route2 0.254: OUTPUTS.5 12.55,14.06 12.58,14.07 10.04,14.04 10.01,1.49 22.71,1.52 22.8,5.09 v42.26,5.09 42.26,5.59 49.38,5.59 49.38,7.63 v49.77,7.6
  Route15 0.254: v48.53,32.22 49.73,32.19 v49.77,7.6
INJFLT_LED_A
  Top 0.254: 26.77,13.78 26.77,13.72 | 26.77,13.78 R10.1 | INJFLT_LED.A 26.77,14.15 26.77,13.78
INJFLT_LED_C  (via drill 0.25)
  Top 0.254: U2.10 43.79,7.83 v43.79,4.57 | 19.4,14.15 19.4,14.22 | 19.4,14.15 INJFLT_LED.C | v19.36,12.95 19.4,12.95 19.4,14.15
  Route2 0.254: v43.79,4.57 43.79,3.05 v24.34,2.99 | v24.32,12.9 v19.36,12.95
  Route15 0.254: v24.34,2.99 24.32,3 v24.32,12.9
INJIN  (via drill 0.25)
  Top 0.254: U1.13 50.14,30.28 50.14,30.23 v48.11,30.23 | USB_SPI_DONGLE.16 23.72,38.84
  Top 0.406: 23.72,38.44 23.72,38.35 | 23.72,38.44 C19.1 | 23.72,38.84 23.72,38.44
  Route2 0.254: v48.11,30.23 48.11,29.97 33.63,29.97 33.63,37.34 28.8,37.34 28.8,40.13 21.44,40.13 21.44,38.86 7.21,38.86 USB_SPI_DONGLE.16
INJOUT  (via drill 0.38)
  Top 0.406: D5.C 88.25,26.07 88.25,25.12 91.06,25.12 91.06,26.54 | 91.06,26.54 | 91.06,26.54 C9.1 96.22,26.54 96.22,27.03 | 96.22,27.03 96.22,27.15 | X5.1 96.22,27.03 | U1.27 62.58,34.83 v62.58,34.8
  Route15 0.406: 96.37,27.03 96.37,26.92 | 96.37,27.03 X5.1 | 96.37,27.18 96.37,27.03
  Route15 0.813: v62.58,34.8 93.32,34.8 93.32,27.18 96.37,27.18
ISO9141  (via drill 0.25)  (1 unrouted)
  Top 0.254: U1.5 51.78,35.48 51.78,26.85 51.81,26.85 51.81,21.49 67.45,21.49 | R17.2 72,23.01 70.62,21.52 67.45,21.49 | D8.C 67.45,24.51 67.45,21.59 | 67.45,21.49 67.45,21.59 | 67.45,21.59 67.41,21.59 v67.41,21.44 v67.42,21.44
  Route15 0.254: v67.42,21.44 67.37,19.88 | 67.37,19.88 67.37,19.75 | ISO9141.4 77.5,19.4 77.5,19.63 67.36,19.57 67.34,19.88 | 67.34,19.88 67.35,19.88 | 67.37,19.88 67.34,19.88
LAMP_LED_A
  Top 0.406: LAMP_LED.A 90.82,40.97 90.82,42.71 R5.1
LAMPIN  (via drill 0.25)
  Top 0.254: U1.15 48.87,28.98 v48.87,25.15 | 23.72,31.55 23.72,31.56 | 23.72,31.55 C15.1 | USB_SPI_DONGLE.10 23.72,31.22 23.72,31.55
  Route2 0.254: v48.87,25.15 8.74,25.15 v8.74,24.89
  Route15 0.254: v8.74,24.89 5.94,24.89 5.96,30.58 USB_SPI_DONGLE.10 | USB_SPI_DONGLE.10 7.21,31.24 | USB_SPI_DONGLE.10
LAMPOUT  (via drill 0.38)
  Top 0.406: LAMP_LED.C 96.1,38.87 96.1,37.19 X4.1 96.17,37.19 | 96.17,37.19 96.17,37.2 | C8.1 96.17,37.15 96.17,37.19 | U1.24 62.33,32.88 v62.33,32.77
  Route2 0.406: v62.33,32.77 92.81,32.77 92.81,37.08 96.37,37.08 96.37,37.19 X4.1
MRX  (via drill 0.25)
  Top 0.254: C25.1 15.85,6.62 15.85,6.44 OUTPUTS.2 | U2.14 43.68,12.91 v43.68,12.82 | U1.18 61.06,28.98 61.06,28.96 v63.35,28.96
  Route15 0.254: v43.68,12.82 43.77,12.82 43.77,6.34 45.57,6.34 | 45.57,6.34 45.61,6.34 45.61,1.9 15.65,1.9 15.65,4.88 14.3,4.88 14.3,6.33 12.46,6.33 12.46,6.44 OUTPUTS.2 | v63.35,28.96 63.37,6.35 45.59,6.35 45.57,6.34
MRX_LED_A
  Top 0.254: R14.1 27.02,6.6 27.02,6.57 MRX_LED.A
MRX_LED_C  (via drill 0.25)
  Top 0.254: MRX_LED.C 19.4,6.57 v19.4,5.08 | 34.31,11.65 35.78,11.64 U2.4 | v33.77,11.71 34.31,11.65 | 34.31,11.65
  Route2 0.254: v19.4,5.08 21.18,5.08 21.18,5.75 33.58,5.71 v33.55,6.36
  Route15 0.254: v33.55,6.36 33.29,6.35 33.29,11.6 33.77,11.6 v33.77,11.71
MTX  (via drill 0.25)
  Top 0.254: U1.17 61.82,28.33 v61.82,22.61 | USB_SPI_DONGLE.8 C17.1
  Top 0.406: C17.1 23.93,28.52 | C17.1 | C17.1
  Route2 0.254: v61.82,22.61 8.99,22.61 8.99,22.35 2.89,22.35 2.89,27.39 5.97,27.4 6.96,28.68 | 6.96,28.68 6.96,28.7 | 6.96,28.68 USB_SPI_DONGLE.8
N$1
  Top 0.406: +5V_LED.A R18.2
N$2  (via drill 0.25)
  Top 0.254: R21.1 49.63,44.34 v49.63,44.45
  Route15 0.254: 64.36,40 64.36,39.88 | 64.36,40 WD_INH.1 | v49.63,44.45 64.36,44.45 64.36,40
N$4  (via drill 0.25)
  Top 0.254: U2.15 39.72,14.18 v39.72,13.72 | v37.69,11.94 37.31,11.94 37.33,10.32 36.05,10.34 36.05,10.37 | 36.05,10.37 36.05,10.39 | U2.5 36.05,10.37
  Route2 0.254: v39.72,13.72 38.71,13.72 38.7,11.99 37.68,11.99 v37.69,11.94
N$7
  Top 0.254: R2.1 90.87,53.02 90.87,51.17 IGNITION_LED.A
N$8
  Top 0.406: INJ_LED.A 90.78,30.68 90.78,32.26 R3.1
N$9
  Top 0.406: R4.1 90.57,20.27 REL_LED.A
N$12
  Top 0.254: D4.A 82.74,47 82.74,49.35 91.4,49.35 91.4,49.2 | 91.4,49.2 91.4,49.17 | 91.4,49.2 IGNITION_LED.C
N$13
  Top 0.406: D5.A 81.89,28.96 89.4,29.03 90.01,28.37 90.78,28.19 90.78,28.58 INJ_LED.C
N$14
  Top 0.406: REL_LED.C 91.51,18.19 91.54,10.21 93.89,10.21 93.89,10.08 D6.A
N$18
  Top 0.254: 19.38,53.71 19.38,53.65 | 19.38,53.71 R8.1 | VPWR_LED.A 19.38,53.71
N$21
  Route2 0.254: LIN_PWR.2 77,18.32 77,20.87 83.23,20.87 83.23,19.47 | 83.23,19.47 83.23,19.36 | 83.23,19.47 ISO9141.3
N$23  (1 unrouted)
N$33
  Top 0.254: 62.2,60.55 62.2,60.51 | 62.2,60.55 Q3.G | 55.47,60.78 R13.2 | 55.47,60.78 62.2,60.78 62.2,60.55 | 55.47,60.78 | R11.2 55.47,57.71 55.47,60.78
N$43
  Top 0.254: USB_ON_LED.A 4.42,42.2 4.42,46.36 R9.1
RELFLT  (via drill 0.25)
  Top 0.254: C4.1 15.78,11.8 15.78,11.52 OUTPUTS.4 | v44.88,9.09 v44.88,9.1 U2.11 39.87,9.1 v39.87,9.12 | 50.13,31.52 50.12,31.58 | 50.13,31.52 U1.11 | v46.24,31.39 46.63,31.52 50.13,31.52
  Route2 0.254: v39.87,9.12 39.77,9.12 39.71,10.19 12.64,10.19 OUTPUTS.4
  Route15 0.254: v44.88,9.09 46.36,9.09 v46.24,31.39
RELFLT_LED_A
  Top 0.254: R20.1 26.77,11.4 26.77,11.73 RELFLT_LED.A
RELFLT_LED_C  (via drill 0.25)
  Top 0.254: 19.74,11.73 RELFLT_LED.C 19.58,11.73 19.58,11.69 v18.41,11.71 | v39.98,11.18 39.97,11.2 40.49,10.41 41.76,10.41 41.76,10.37 U2.12
  Route2 0.254: v39.98,11.18 39.98,10.97 18.41,10.93 v18.41,11.71
RESET_LED_A
  Top 0.254: R6.1 26.77,16.21 26.81,16.61 RESET_LED.A
RESET_LED_C  (via drill 0.25)
  Top 0.254: U2.2 33.66,14.18 v33.66,14.75 | RESET_LED.C 19.54,18.12 v19.49,18.12
  Route2 0.254: v33.66,14.75 19.49,14.75 v19.49,18.12
RESETB  (via drill 0.25)
  Top 0.254: C14.1 15.75,16.47 15.75,16.61 OUTPUTS.6 | U2.3 v33.85,12.91 33.85,12.92 | U1.9 48.99,32.88 48.99,32.89 44.83,32.89 v44.83,19.02 | R19.1 23.72,18.8 v23.72,18.03
  Route2 0.254: v25.37,12.49 26.32,12.92 v33.85,12.91 33.85,12.8 37.86,12.8 37.86,19.02 v44.83,19.02
  Route15 0.254: v25.37,12.49 25.4,12.93 25.4,15.64 23.72,15.64 | OUTPUTS.6 13.03,16.61 13.03,15.62 23.72,15.64 | 23.72,15.64 | 23.72,15.64 v23.72,18.03
RIN  (via drill 0.25)
  Top 0.254: U1.14 48.9,29.63 v48.11,28.96 | 23.69,33.88 23.69,33.92 | 23.69,33.88 C16.1 | USB_SPI_DONGLE.12 23.69,33.76 23.69,33.88
  Route2 0.254: v48.11,28.96 45.31,28.96 45.31,27.69 16.36,27.69 16.36,34.8 9.75,34.8 9.75,37.59 5.94,37.59 5.94,35.05 7.21,35.05 USB_SPI_DONGLE.12
  Route15 0.254: USB_SPI_DONGLE.12
ROUT  (via drill 0.38)
  Top 0.406: 99.73,10.08 99.73,9.79 | 99.73,10.08 D6.C | X6.1 99.73,16.82 99.73,12.58 | 99.73,12.58 99.73,10.08 | U1.22 62.34,31.58 v62.34,31.56 | 99.73,12.58 99.72,12.58 99.72,12.59 C6.1
  Route2 0.406: 96.63,16.82 96.63,16.64 | 96.63,16.82 X6.1 | 96.63,16.89 96.63,16.82
  Route2 0.813: v62.34,31.56 85.1,31.56 85.1,16.89 96.63,16.89
TEST1
  Top 0.254: U1.30 58.52,36.78 58.52,41.66 55.22,41.66 55.22,44.96 53.44,44.96 53.44,44.89 R15.1 53.19,44.89 53.19,49.21 | 53.19,49.21 53.19,49.28 | 53.19,49.21 TEST2.1
TEST2
  Top 0.254: U1.31 59.03,37.43 59.03,44.96 60.3,44.96 60.3,45 | 60.3,49.35 60.3,49.53 | 60.3,49.35 TEST1.1 | 60.3,45 R1.1 | 60.3,45 60.3,49.35
TEST3
  Top 0.254: U1.32 62.33,38.08 62.33,43.43 66.65,43.43 66.65,49.36 | 66.65,49.36 66.65,49.53 | 66.65,49.36 TEST3.1
VBAT
  Top 0.406: 13.82,62.71 13.82,62.99 | D1.A 13.82,62.71 | 13.82,62.71 13.82,62.13
  Top 1.27: VBAT.1 10.13,57.56 10.13,62.54 13.82,62.54 | 13.82,62.54 13.82,62.71 D1.A | 13.82,62.54 13.82,62.33
VCCREF  (via drill 0.25)
  Top 0.254: Q1.1 v37.58,32.01 | v47.94,34.13 47.96,34.16 50.09,34.16 50.11,34.18 U1.7
  Route2 0.254: v37.58,32.01 47.59,32.09 v47.94,34.13
VDD  (via drill 0.25, 0.38)
  Top 0.254: C22.1 40,4.08 40.03,4.06 40.16,4.08 40.16,5.61 38.45,5.59 38.45,15.49 35.91,15.49 35.91,15.45 U2.1 35.14,15.49 | 28.8,13.46 29.2,13.61 R10.2 | 29.25,16.14 R6.2 28.82,16.21 | 28.8,11.18 29.27,11.36 R20.2 | 28.8,8.89 29.24,8.88 R7.2 | 28.8,6.35 29.24,6.57 R14.2 29.18,6.47 | 29.06,3.81 29.18,3.73 C20.1 | 39.6,44.4 39.44,44.41 | IGNSUP.1 47.1,35.79 | 50.25,34.83 U1.6 | 39.72,32.77 39.8,32.81 v39.77,32.76
  Top 0.406: 29.25,16.14 29.2,13.61 29.27,11.36 29.24,8.88 29.24,6.57 | 29.18,3.73 29.18,6.47 | 47.1,35.79 47.1,35.85 48.67,34.87 50.25,34.83 | 46.07,44.34 R21.2 | 46.07,44.34 46.07,44.2 | 46.07,44.34 45.72,44.34 v45.72,46.23 | C5.1 39.72,44.63 39.72,44.42 v41.52,44.42 41.5,50.29 40.23,50.29 40.2,50.32 R18.1 | 35.15,42.67 35.15,42.41 C2.+ | R6.2 29.04,16.21 29.02,17.69 35.62,17.67 | 34.98,17.61 35.11,17.64 35.11,17.61 | R19.2 28.82,18.8 28.82,16.21
  Top 0.813: 35.14,15.49 35.11,17.61 35.57,17.64 39.68,17.69 | C5.1 39.6,44.4 38.17,44.34 36.74,42.4 C2.+ | 35.62,17.67 35.11,17.64
  Top 1.016: VDD.1 30.21,42.43 35.15,42.41 | v39.77,32.76 39.77,35.46 Q1.2 39.86,35.45 | 39.68,17.69 39.8,32.81 | 39.86,35.45 39.86,35.33 | 39.86,35.45 39.86,36.14 39.9,36.14 39.89,38.91 36.67,38.85 35.11,38.83 35.12,42.52 C2.+ | C2.+ | C2.+
  Route2 0.254: 47.09,35.81 47.09,35.79 IGNSUP.1
  Route2 0.406: v45.72,46.23 41.5,46.23 v41.52,44.42 | v39.77,32.76 47.09,32.76 47.09,35.79
  pour Top: 0.35,50.04 42.01,50.04 42.01,18.03 45.31,18.03 45.31,1.27 0.35,1.27
VDD_USB
  Top 0.254: USB_SPI_DONGLE.11 2.89,33.76 2.89,48.26 6.96,48.26 6.96,46.36 R9.2 10.26,46.36 10.26,40.73 | 10.26,40.73 10.26,40.64 | 10.26,40.73 C3.1
VPWR  (1 unrouted)
  Top 0.254: 24.23,53.49 24.3,53.55 24.31,53.72 | 21.44,56.99 21.69,56.99 | 42.18,35.55 42.18,35.45 Q1.3 | C23.1 42.18,32.93 | 33.63,62.26 33.79,62.26 33.79,62.47 | 43.99,35.31 44.04,35.31 44.05,33.45 | U1.8 49.11,33.54 48.6,33.45 44.05,33.45 | 44.05,33.45 44.09,33.42 | R4.2 77.06,23.81 77.06,23.88 | 77.06,23.88 77.06,30.99 75.79,30.99 75.79,30.69 D7.A | 77.06,23.88 75.54,23.88 75.54,20.86 LIN_PWR.1 73.38,20.86 73.38,19.84 69.97,19.84 69.97,14.98 C24.1
  Top 0.406: 42.18,32.93 42.18,35.45 | IGNSUP.3 44.07,40.87 43.99,40.87 | 43.99,35.17 43.99,35.31 | Q1.3 42.24,35.45 | R4.2 92.2,23.81 92.2,22.42 96.32,22.42 X6.2 | X6.2 96.32,21.81 | X6.2 | 96.27,42.22 96.27,42.21 | X4.2 96.27,42.22 | R5.2 96.27,44.61 96.27,42.22 | C10.1 90.52,33.97 90.52,34.16 R3.2 96.11,34.16 96.11,32.06 | 96.11,32.06 96.11,32 | X5.2 96.11,32.06 | R2.2 90.04,54.93 90.04,60.51
  Top 1.016: 28.04,62.84 C1.+ | 28.04,62.84 28.04,62.71 D1.C 21.44,62.71 | 21.44,62.71 21.44,62.99 | D2.C 21.44,56.99 21.44,62.71 | C11.1 33.63,60.8 33.63,62.26 33.63,62.84 28.04,62.84 | 24.3,53.55 VPWR.1 | 24.31,53.72 R8.2 21.69,53.71 21.69,56.99 | 44.07,40.87 44.07,61.94 44.07,62.47 33.79,62.47 | 43.99,35.31 43.99,40.87 | 43.99,35.17 42.24,35.17 42.24,35.45
  Top 1.27: X2.2 96.27,52.39 96.27,60.51 90.04,60.51 85.58,60.51 85.58,65.58 44.13,65.58 44.13,61.94 44.07,61.94 | 97.18,52.27 99.65,52.24 99.65,41.98 | 99.65,41.98 99.74,41.75 | X4.2 96.98,42.22 96.98,42.01 | 96.98,42.01 99.65,41.98 | 96.98,42.01 99.71,42 99.71,31.98 96.94,31.99 | 96.94,31.99 96.94,32.03 X5.2 | 96.94,31.99 96.94,31.9 99.66,31.9 99.55,21.77 97.43,21.86 97.43,21.84 | 97.43,21.84 97.43,21.78 | X6.2 97.43,21.84
  Route15 0.127: 21.15,62.67 21.15,62.71
  pour Top: 23.21,68.58 100.94,68.58 100.94,0.51 59.03,0.51 59.03,40.39 42.77,40.39 42.77,59.18 22.2,59.18 22.2,68.58 22.96,68.58
WD_INH
  Top 0.254: 66.9,40 66.9,40.03 | 66.9,40 WD_INH.2 | U1.29 66.9,36.13 66.9,40
WDRFSH
  Top 0.254: WDRFSH.1 59.11,24.84 59.11,29.59 60.76,29.59 | 60.76,29.59 60.76,29.63 U1.19 | 60.76,29.59 60.67,29.62

### Text on the board
tNames: A | C | VPWR | MCZ33812 EVALUATION BOARD | + | G | A | C | E | VPWR | VDD_LED | C | A | VPWR_LED | IGNITION | A | GND | VPWR | GND | TEST1 | TEST2 | TEST3 | A | C | C | PWA-700-25874 | + | PWB-178-25874 | A | C | VPWR | A | LAMP | ENABLE | GND | INJIN | C | VDD | MCZ33812 | IGNIN | RIN | VDD | C | A | A | A | LAMPIN | INJECTOR | MTX | C | C | C | A | CNTL0 | C | 1 | A | RESETB | C | A | C | INJFLT | RELAY | C | A | RELFLT | C | A | IGNFLT | A | C | A | C | MRX | KIT33812EKEVEVBE | C | A | GND | REV 2.2